# EAGLE design sam3u_breakout (EAGLE 6.3)
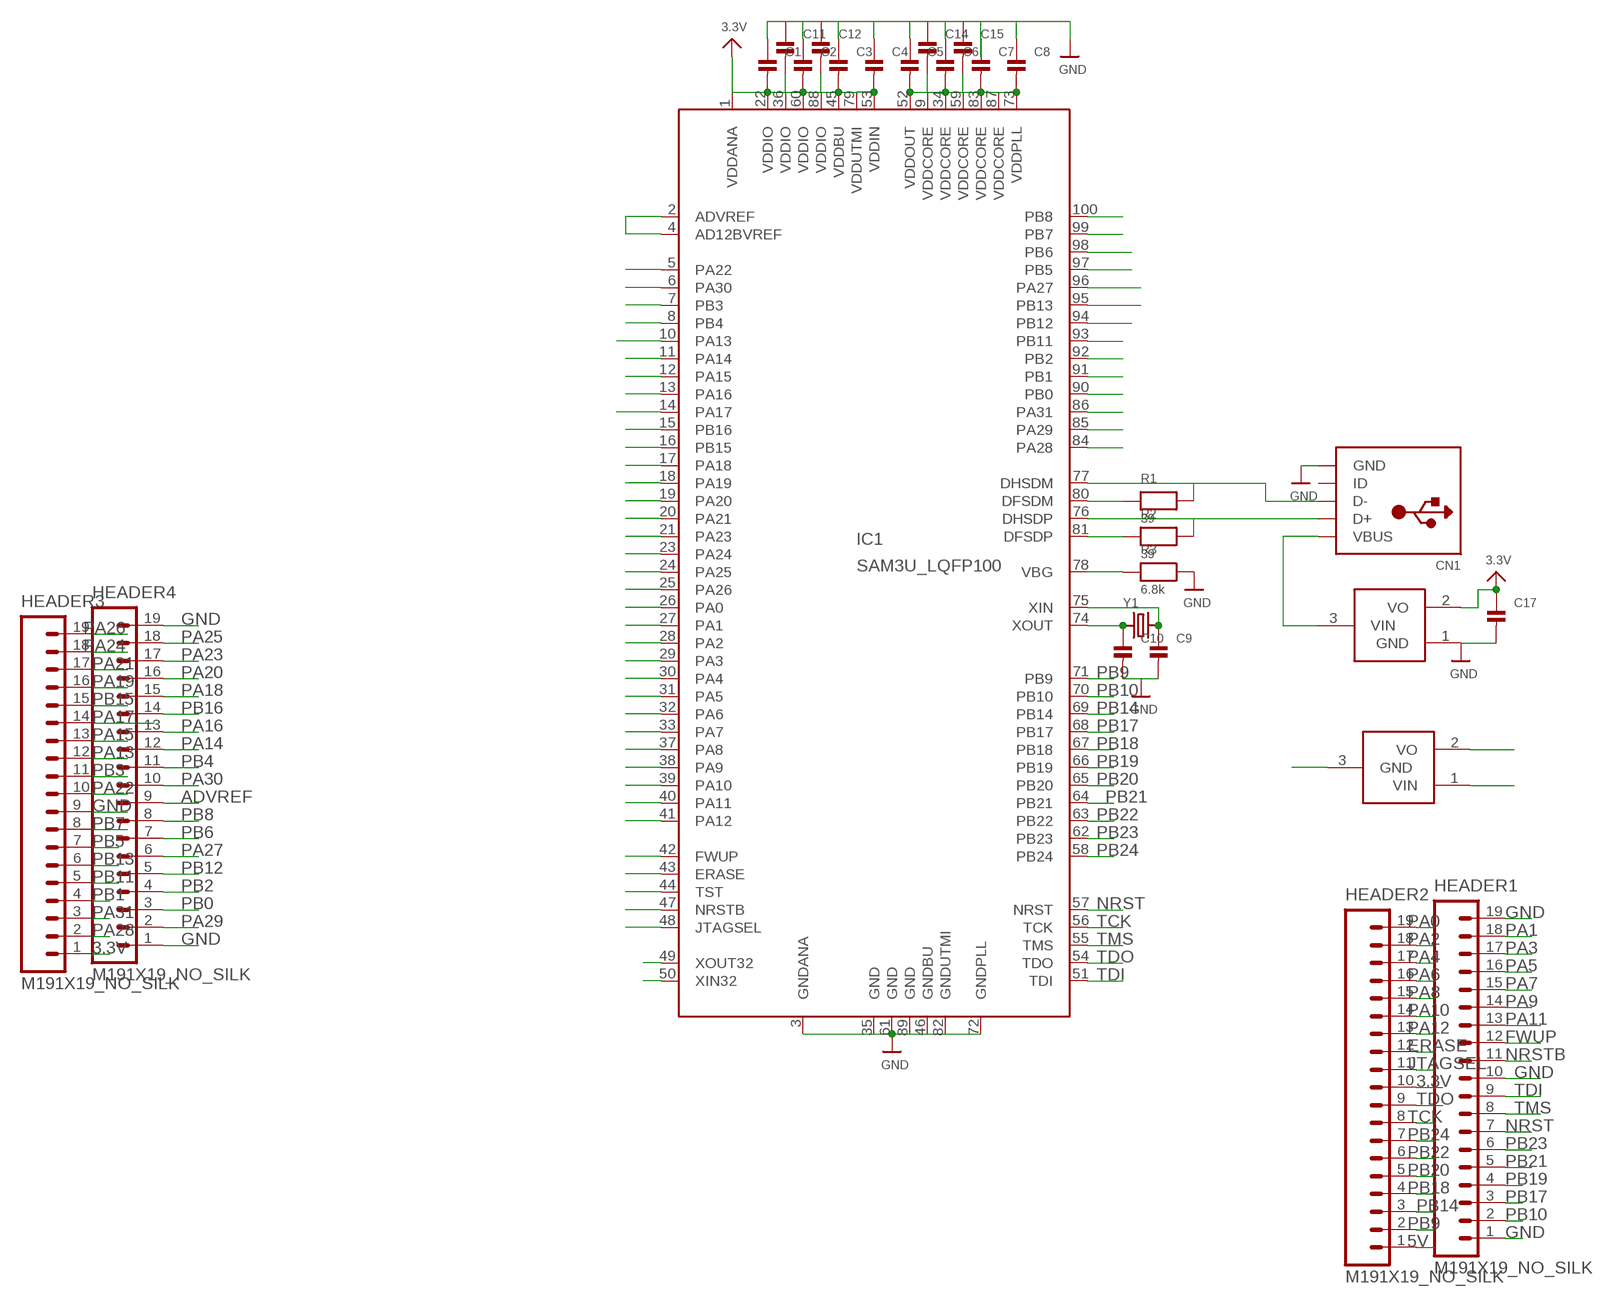
[diagram p0: schematic, sheet 1]

## Parts
C1  CAP_CERAMIC0402  [0402]
C2  CAP_CERAMIC0402  [0402]
C3  CAP_CERAMIC0402  [0402]
C4  CAP_CERAMIC0402  [0402]
C5  CAP_CERAMIC0402  [0402]
C6  CAP_CERAMIC0402  [0402]
C7  CAP_CERAMIC0402  [0402]
C8  CAP_CERAMIC0402  [0402]
C9  CAP_CERAMIC0402  [0402]
C10  CAP_CERAMIC0402  [0402]
C11  CAP_CERAMIC0402  [0402]
C12  CAP_CERAMIC0402  [0402]
C14  CAP_CERAMIC0402  [0402]
C15  CAP_CERAMIC0402  [0402]
C17  CAP_CERAMIC0402  [0402]
CN1  USBMICROB  [USB-MICROB]
HEADER1  M191X19_NO_SILK  [1X19_NO_SILK]
HEADER2  M191X19_NO_SILK  [1X19_NO_SILK]
HEADER3  M191X19_NO_SILK  [1X19_NO_SILK]
HEADER4  M191X19_NO_SILK  [1X19_NO_SILK]
IC1  SAM3U_LQFP100  [LQFP100]
R1  39  RESISTOR0603  [0603]
R2  39  RESISTOR0603  [0603]
R3  6.8k  RESISTOR0603  [0603]
U$7  VREG  [SOT23-3]
U$14  VREF  [SOT23-3]
Y1  CRYSTALSMD  [HC49UP]

## Nets
1.8V: C5.2 C6.2 C7.2 C8.2 C14.2 C15.2 IC1.9(VDDCORE) IC1.34(VDDCORE) IC1.52(VDDOUT) IC1.59(VDDCORE) IC1.73(VDDPLL) IC1.83(VDDCORE) IC1.87(VDDCORE)
3.3V: C1.2 C2.2 C3.2 C4.2 C11.2 C12.2 C17.1 HEADER2.10 HEADER3.1 IC1.1(VDDANA) IC1.22(VDDIO) IC1.36(VDDIO) IC1.45(VDDBU) IC1.53(VDDIN) IC1.60(VDDIO) IC1.79(VDDUTMI) IC1.88(VDDIO) U$7.2(VO) U$14.1(VIN)
5V: CN1.P1(VBUS) HEADER2.1 U$7.3(VIN)
ADVREF: HEADER4.9 IC1.2(ADVREF) IC1.4(AD12BVREF) U$14.2(VO)
ERASE: HEADER2.12 IC1.43(ERASE)
FWUP: HEADER1.12 IC1.42(FWUP)
GND: C1.1 C2.1 C3.1 C4.1 C5.1 C6.1 C8.1 C9.2 C10.2 C11.1 C12.1 C14.1 C15.1 C17.2 CN1.P5(GND) HEADER1.1 HEADER1.10 HEADER1.19 HEADER3.9 HEADER4.1 HEADER4.19 IC1.3(GNDANA) IC1.35(GND) IC1.46(GNDBU) IC1.61(GND) IC1.72(GNDPLL) IC1.82(GNDUTMI) IC1.89(GND) R3.2 U$7.1(GND) U$14.3(GND)
JTAGSEL: HEADER2.11 IC1.48(JTAGSEL)
N$1: CN1.P3(D+) IC1.76(DHSDP) R2.2
N$2: IC1.80(DFSDM) R1.1
N$4: IC1.81(DFSDP) R2.1
N$5: CN1.P2(D-) IC1.77(DHSDM) R1.2
N$6: IC1.78(VBG) R3.1
N$7: C9.1 IC1.75(XIN) Y1.2
N$8: C10.1 IC1.74(XOUT) Y1.1
N$17: IC1.49(XOUT32)
N$18: IC1.50(XIN32)
NRST: HEADER1.7 IC1.57(NRST)
NRSTB: HEADER1.11 IC1.47(NRSTB)
PA0: HEADER2.19 IC1.26(PA0)
PA1: HEADER1.18 IC1.27(PA1)
PA2: HEADER2.18 IC1.28(PA2)
PA3: HEADER1.17 IC1.29(PA3)
PA4: HEADER2.17 IC1.30(PA4)
PA5: HEADER1.16 IC1.31(PA5)
PA6: HEADER2.16 IC1.32(PA6)
PA7: HEADER1.15 IC1.33(PA7)
PA8: HEADER2.15 IC1.37(PA8)
PA9: HEADER1.14 IC1.38(PA9)
PA10: HEADER2.14 IC1.39(PA10)
PA11: HEADER1.13 IC1.40(PA11)
PA12: HEADER2.13 IC1.41(PA12)
PA13: HEADER3.12 IC1.10(PA13)
PA14: HEADER4.12 IC1.11(PA14)
PA15: HEADER3.13 IC1.12(PA15)
PA16: HEADER4.13 IC1.13(PA16)
PA17: HEADER3.14 IC1.14(PA17)
PA18: HEADER4.15 IC1.17(PA18)
PA19: HEADER3.16 IC1.18(PA19)
PA20: HEADER4.16 IC1.19(PA20)
PA21: HEADER3.17 IC1.20(PA21)
PA22: HEADER3.10 IC1.5(PA22)
PA23: HEADER4.17 IC1.21(PA23)
PA24: HEADER3.18 IC1.23(PA24)
PA25: HEADER4.18 IC1.24(PA25)
PA26: HEADER3.19 IC1.25(PA26)
PA27: HEADER4.6 IC1.96(PA27)
PA28: HEADER3.2 IC1.84(PA28)
PA29: HEADER4.2 IC1.85(PA29)
PA30: HEADER4.10 IC1.6(PA30)
PA31: HEADER3.3 IC1.86(PA31)
PB0: HEADER4.3 IC1.90(PB0)
PB1: HEADER3.4 IC1.91(PB1)
PB2: HEADER4.4 IC1.92(PB2)
PB3: HEADER3.11 IC1.7(PB3)
PB4: HEADER4.11 IC1.8(PB4)
PB5: HEADER3.7 IC1.97(PB5)
PB6: HEADER4.7 IC1.98(PB6)
PB7: HEADER3.8 IC1.99(PB7)
PB8: HEADER4.8 IC1.100(PB8)
PB9: HEADER2.2 IC1.71(PB9)
PB10: HEADER1.2 IC1.70(PB10)
PB11: HEADER3.5 IC1.93(PB11)
PB12: HEADER4.5 IC1.94(PB12)
PB13: HEADER3.6 IC1.95(PB13)
PB14: HEADER2.3 IC1.69(PB14)
PB15: HEADER3.15 IC1.16(PB15)
PB16: HEADER4.14 IC1.15(PB16)
PB17: HEADER1.3 IC1.68(PB17)
PB18: HEADER2.4 IC1.67(PB18)
PB19: HEADER1.4 IC1.66(PB19)
PB20: HEADER2.5 IC1.65(PB20)
PB21: HEADER1.5 IC1.64(PB21)
PB22: HEADER2.6 IC1.63(PB22)
PB23: HEADER1.6 IC1.62(PB23)
PB24: HEADER2.7 IC1.58(PB24)
TCK: HEADER2.8 IC1.56(TCK)
TDI: HEADER1.9 IC1.51(TDI)
TDO: HEADER2.9 IC1.54(TDO)
TMS: HEADER1.8 IC1.55(TMS)
TST: IC1.44(TST)
Unconnected: C7.1 CN1.P4(ID)

## Library data of the parts
C1-C12 C14 C15 C17 = nonolith:CAP_CERAMIC: Ceramic Capacitors 0402 - 0402 Surface Mount Capacitors 0.1uF 10V 10% [Digikey: 490-1318-2-ND] 0603 - 0603 Surface Mount Capacitors 16 pF 50V 5% [Digikey: 445-5051-2-ND] 22 pF 50V [Digikey: PCC220ACVTR-ND] 33 pF 50V 5% [Digikey: 490-1415-1-ND] 56pF 50V 5% [Digikey: 490-1421-1-ND] 220pF 50V 5% [Digikey: 445-1285-1-ND] 680 pF 50V 2200 pF 50V 5% C0G [Digikey: 445-1297-1-ND] 5600 pF 100V 5% X7R [Digikey: 478-3711-1-ND] 0.1 µF 25V 10% [Digikey: PCC2277TR-ND] 0.22 µF 16V 10% X7R [Digikey: 445-1318-1-ND] 1.0 µF 25V 10% [Digikey: 445-5146-2-ND] 0603 - RF Specific 3pF 250V +/-0.1pF RF [Digikey: 712-1347-1-ND] 18 pF 250V 5% [Digikey: 478-3505-1-ND or 712-1322-1-ND] 56 pF 250V 5% C0G RF [Digikey: 490-4867-1-ND] 68 pF 250V RF [Digikey: 490-4868-1-ND] 0805 - 0805 Surface Mount Capacitors 220 pF 250V 2% RF Ceramic Capacitor [Digikey: 712-1398-1-ND] 1000 pF 50V 2% NP0 Ceramic Capacitor [Digikey: 478-3760-1-ND] 0.1 µF 25V 10% Ceramic Capacitor [Digikey: PCC1828TR-ND] 1.0 µF 16V 10% Ceramic Capacitor[Digikey: 490-1691-2-ND] 10.0 µF 10V 10% Ceramic Capacitor[Digikey: 709-1228-1-ND] 1206 - 1206 Surface Mount Capacitors
CN1 = nonolith:USB: USB Connectors USBMINIB - Surface Mount Female Mini-B USB Connector 4UConnector: 06564 By microbuilder.eu
HEADER1-HEADER4 = SparkFun-Connectors:M19: 1x19 .1" header
IC1 = nonolith:SAM3U_LQFP100: sam3u_lqfp100 edit this description Auto generated by make-symbol-device-package-bsdl.ulp Rev. 43 Source: sam3u_lqfp100.csv
R1-R3 = nonolith:RESISTOR: Resistors 0402 - 0402 Surface Mount Package 10.0K 1% 1/16W [Digikey: 311-10.0KLRTR-ND] 0603 - 0603 Surface Mount Package 0 Ohm 1/10 Watt 1% Resistor 15 Ohm 1/10 Watt 1% Resistor 33 Ohm 1/10 Watt 1% Resistor 49.9 Ohm 1/10 Watt 1% Resistor 100 Ohm 1/10 Watt 1% Resistor 150 Ohm 1/10 Watt 1% Resistor 240 Ohm 1/10 Watt 1% Resistor 390 Ohm 1/10 Watt 1% Resistor 560 Ohm 1/10 Watt 1% Resistor 750 Ohm 1/10 Watt 1% Resistor 1.0K Ohm 1/10 Watt 1% Resistor 1.5K Ohm 1/10 Watt 1% Resistor 2.0K Ohm 1/10 Watt 1% Resistor 4.7K Ohm 1/10 Watt 1% Resistor 10.0K Ohm 1/10 Watt 1% Resistor 20.0K Ohm 1/10 Watt 1% Resistor 33.0K Ohm 1/10 Watt 1% Resistor 100.0K Ohm 1/10 Watt 1% Resistor 0805 - 0805 Surface Mount Package 0 Ohm 1/8 Watt 1% Resistor 33 Ohm 1/8 Watt 1% Resistor 100 Ohm 1/8 Watt 1% Resistor 150 Ohm 1/8 Watt 1% Resistor 200 Ohm 1/8 Watt 1% Resistor 240 Ohm 1/8 Watt 1% Resistor 330 Ohm 1/8 Watt 1% Resistor 390 Ohm 1/8 Watt 1% Resistor 470 Ohm 1/8 Watt 1% Resistor 1.0K Ohm 1/8 Watt 1% Resistor 1.5K Ohm 1/8 Watt 1% Resistor 2.0K Ohm 1/8 Watt 1% Resistor 4.7K Ohm 1/8 Watt 1% Resistor 5.1K Ohm 1/8 Watt 1% Resistor 5.6K Ohm 1/8 Watt 1% Resistor 10.0K Ohm 1/8 Watt 1% Resistor 22.0K Ohm 1/8 Watt 1% Resistor 33.0K Ohm 1/8 Watt 1% Resistor 100K Ohm 1/8 Watt 1% Resistor 1206 - 1206 Surface Mount Package
U$7 = nonolith:VREG
U$14 = nonolith:VREF
Y1 = nonolith:CRYSTAL: Crystals HC49UP - Surface Mount Crystal 4.0MHz 18pF +/-30ppm Surface Mount Crystal [Digikey: 535-9857-1-ND] 12.0 MHz Surface Mount Crystal [Digikey: 535-9869-6-ND] 25.0 MHz Surface Mount Crystal [Digikey: 535-9078-1-ND] 3.2 x 2.5mm - MEMs SMT Crystal 12.0 MHz 8pF 15ppm 3.2 x 2.5mm Crystal [Digikey: 644-1047-1-ND] 16.0 MHz 8pF 15ppm 3.2 x 2.5mm Crystal [Digikey: 644-1049-1-ND] 16.0 MHz 10pF 10ppm 3.2 x 2.5mm Crystal [Digikey: 644-1100-1-ND] 27.12 MHz 18pF 30ppm 3.2 x 2.5mm Crystal [Digikey: 887-1424-1-ND] 4.9 x 1.8mm - MEMs SMT Crystal 32.768 KHz 12.5pF 20ppm 4.9 x 1.8mm Crystal [Digikey: SE2415CT-ND] Cylinder 32.768KHz Cylinder Crystal

## Board
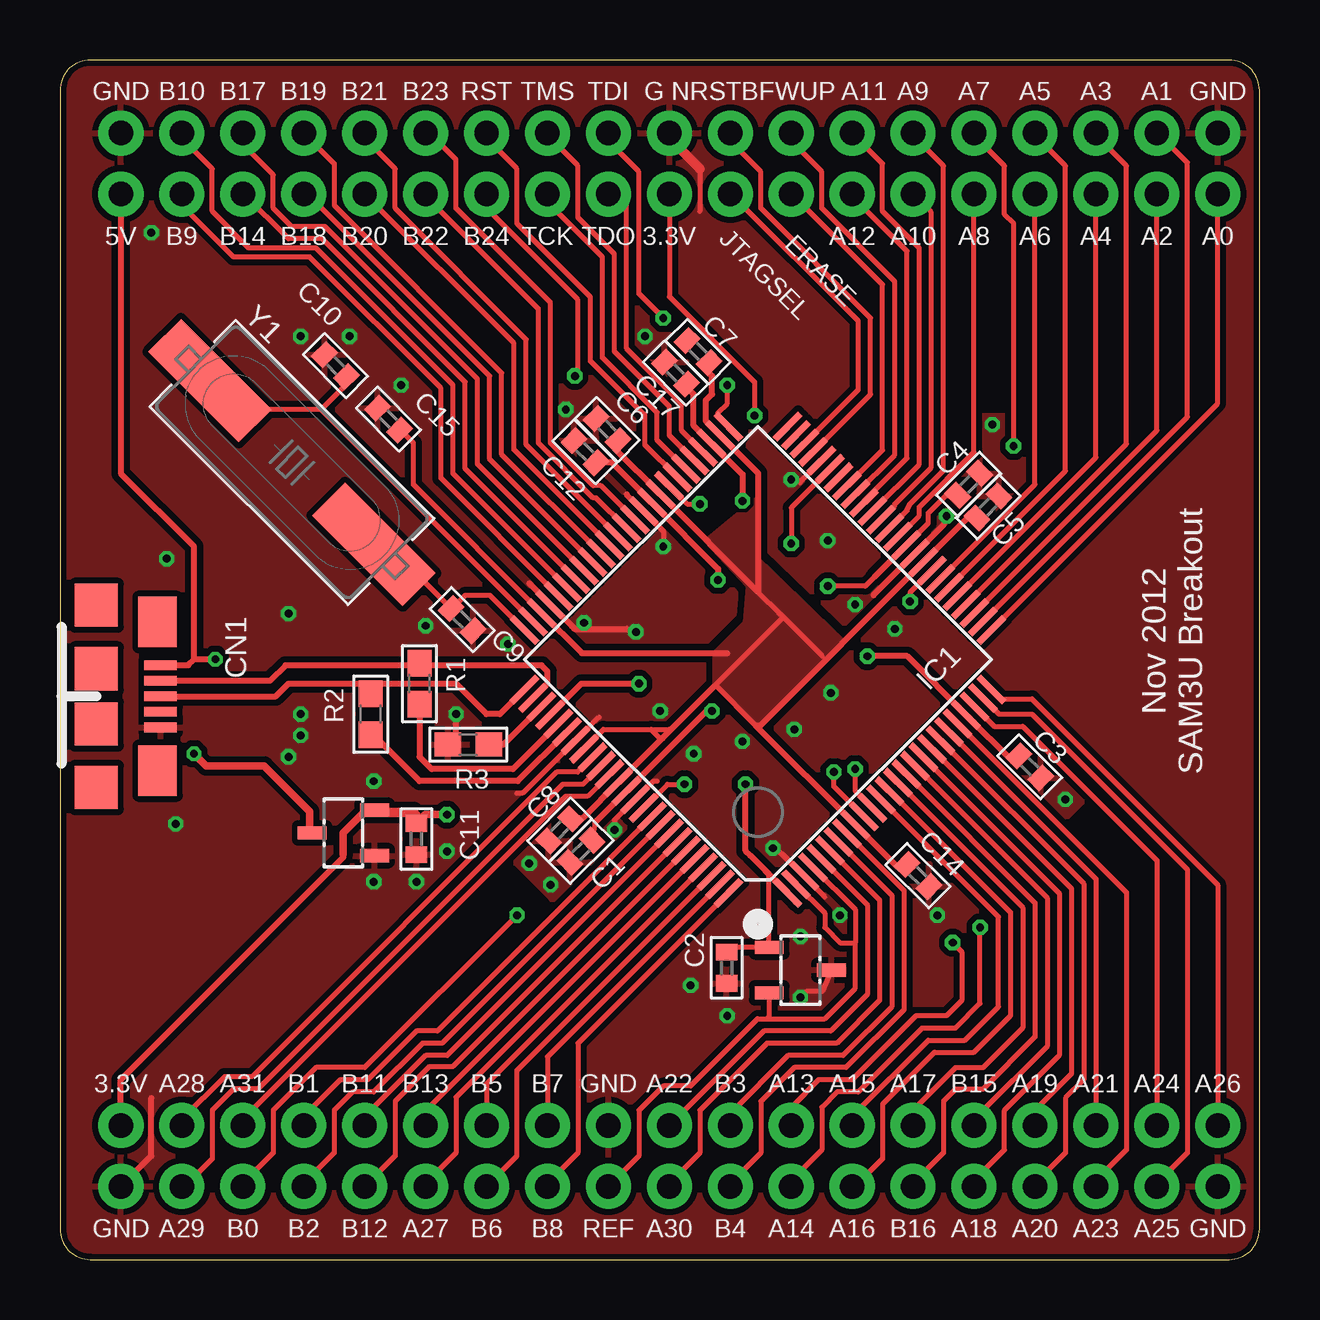
[diagram p1: board, top side]
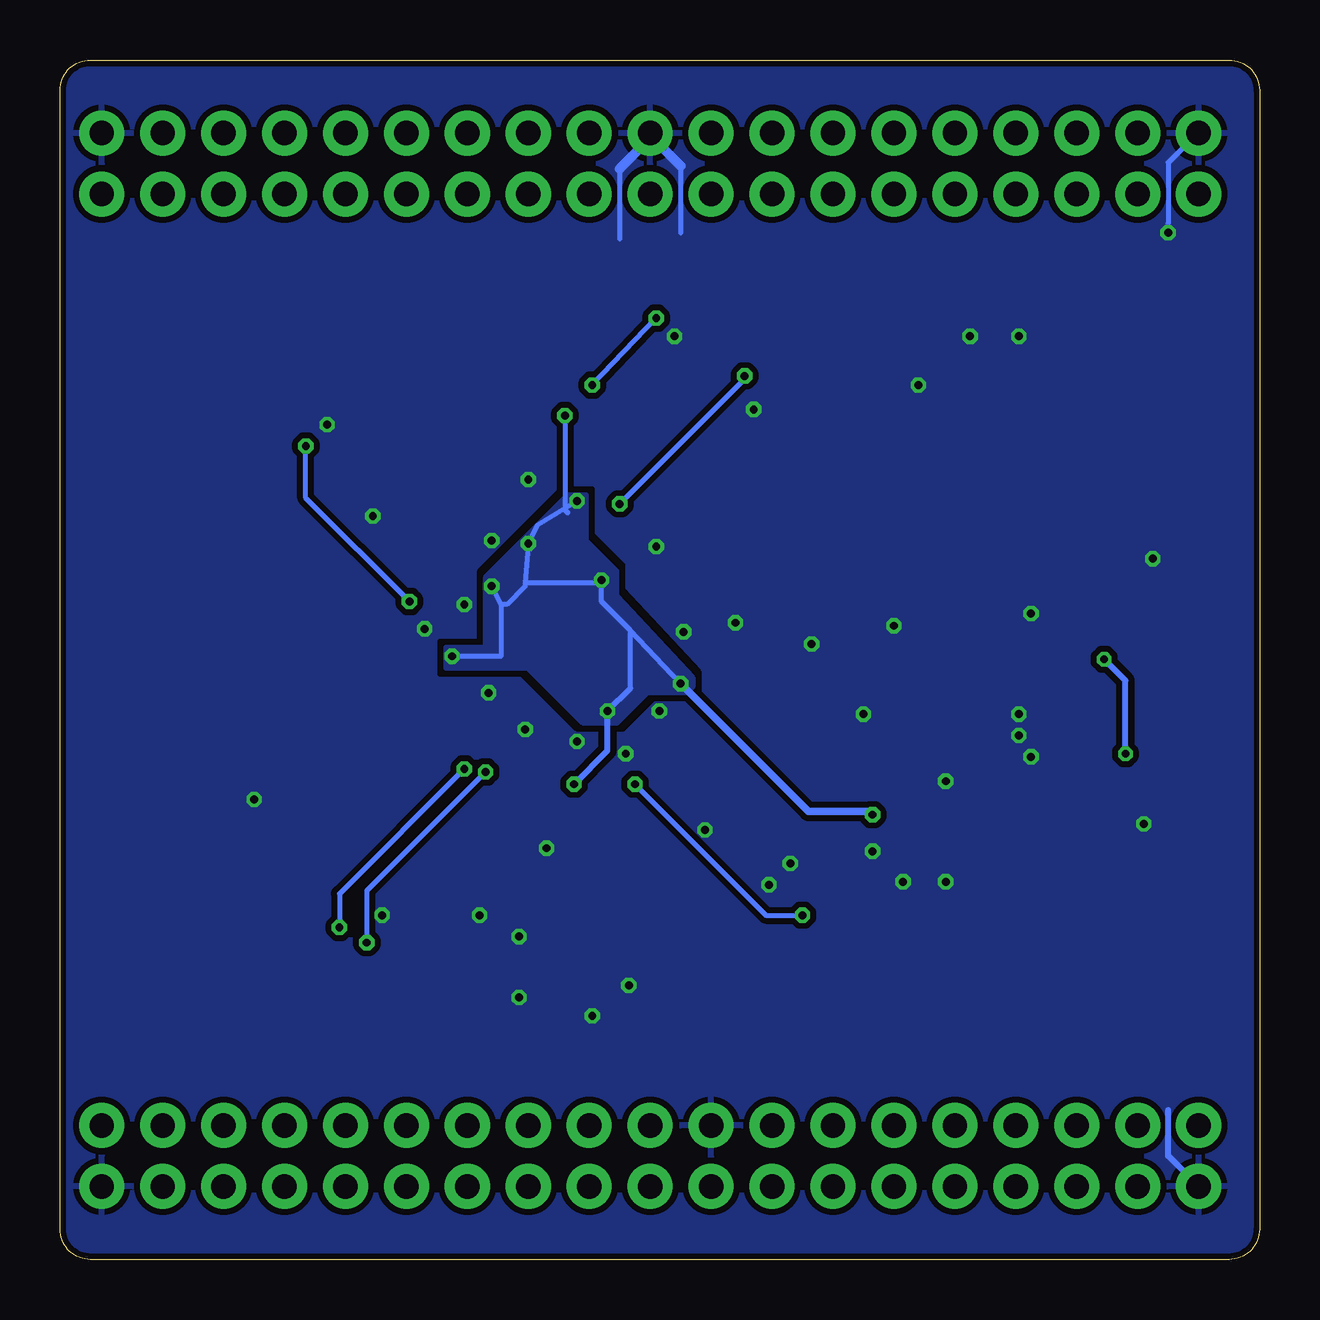
[diagram p2: board, bottom side, seen from below]

Size 50 x 50 mm. Coordinates in mm from the lower left corner, seen from the top.
Outline: 0,48.73 0,1.27 arc90 1.27,0 48.73,0 arc90 50,1.27 50,48.73 arc90 48.73,50 1.27,50 arc90 0,48.73
Copper layers (1*16): Top 0.035mm / dielectric 1.5mm / Bottom 0.035mm
Design rules "default": minimum track width 6mil, minimum drill 12mil, track to track 6mil, track to pad 6mil, pad to pad 6mil, via to via 6mil, smd to smd 0mil, copper to edge 10mil, drill to drill 10mil, minimum pad ring 10mil, minimum via ring 6mil, stop-mask expansion 20mil, vias tented up to drill 100mil, thermal gap 10mil
tRestrict: 3 lines

### Footprints (pad centres in the part's own frame; a part is rotated, then mirrored left to right if it is on the bottom)
0402 = smd 0.7 x 0.9: 1 -0.65,0; 2 0.65,0
USB-MICROB = smd 0.4 x 1.35: P1 -1.3,2.675; P2 -0.65,2.675; P3 0,2.675; P4 0.65,2.675; P5 1.3,2.675 | smd 1.8 x 1.8: PAD-LB -1.15,0; PAD-LLB -3.8,0; PAD-RB 1.15,0; PAD-RRB 3.8,0 | smd 2.1 x 1.6: PAD-LT -3.1,2.55; PAD-RT 3.1,2.55
1X19_NO_SILK = drill 1.016 pad 1.88: 1 0,0; 2 2.54,0; 3 5.08,0; 4 7.62,0; 5 10.16,0; 6 12.7,0; 7 15.24,0; 8 17.78,0; 9 20.32,0; 10 22.86,0; 11 25.4,0; 12 27.94,0; 13 30.48,0; 14 33.02,0; 15 35.56,0; 16 38.1,0; 17 40.64,0; 18 43.18,0; 19 45.72,0
LQFP100 = smd 0.27 x 1.5: 1 -6,-7.75; 2 -5.5,-7.75; 3 -5,-7.75; 4 -4.5,-7.75; 5 -4,-7.75; 6 -3.5,-7.75; 7 -3,-7.75; 8 -2.5,-7.75; 9 -2,-7.75; 10 -1.5,-7.75; 11 -1,-7.75; 12 -0.5,-7.75; 13 0,-7.75; 14 0.5,-7.75; 15 1,-7.75; 16 1.5,-7.75; 17 2,-7.75; 18 2.5,-7.75; 19 3,-7.75; 20 3.5,-7.75; 21 4,-7.75; 22 4.5,-7.75; 23 5,-7.75; 24 5.5,-7.75; 25 6,-7.75; 51 6,7.75; 52 5.5,7.75; 53 5,7.75; 54 4.5,7.75; 55 4,7.75; 56 3.5,7.75; 57 3,7.75; 58 2.5,7.75; 59 2,7.75; 60 1.5,7.75; 61 1,7.75; 62 0.5,7.75; 63 0,7.75; 64 -0.5,7.75; 65 -1,7.75; 66 -1.5,7.75; 67 -2,7.75; 68 -2.5,7.75; 69 -3,7.75; 70 -3.5,7.75; 71 -4,7.75; 72 -4.5,7.75; 73 -5,7.75; 74 -5.5,7.75; 75 -6,7.75 | smd 1.5 x 0.27: 26 7.75,-6; 27 7.75,-5.5; 28 7.75,-5; 29 7.75,-4.5; 30 7.75,-4; 31 7.75,-3.5; 32 7.75,-3; 33 7.75,-2.5; 34 7.75,-2; 35 7.75,-1.5; 36 7.75,-1; 37 7.75,-0.5; 38 7.75,0; 39 7.75,0.5; 40 7.75,1; 41 7.75,1.5; 42 7.75,2; 43 7.75,2.5; 44 7.75,3; 45 7.75,3.5; 46 7.75,4; 47 7.75,4.5; 48 7.75,5; 49 7.75,5.5; 50 7.75,6; 76 -7.75,6; 77 -7.75,5.5; 78 -7.75,5; 79 -7.75,4.5; 80 -7.75,4; 81 -7.75,3.5; 82 -7.75,3; 83 -7.75,2.5; 84 -7.75,2; 85 -7.75,1.5; 86 -7.75,1; 87 -7.75,0.5; 88 -7.75,0; 89 -7.75,-0.5; 90 -7.75,-1; 91 -7.75,-1.5; 92 -7.75,-2; 93 -7.75,-2.5; 94 -7.75,-3; 95 -7.75,-3.5; 96 -7.75,-4; 97 -7.75,-4.5; 98 -7.75,-5; 99 -7.75,-5.5; 100 -7.75,-6
0603 = smd 1.1 x 1: 1 -0.85,0; 2 0.85,0
SOT23-3 = smd 0.55 x 1.2: 1 0.95,1.3; 2 -0.95,1.3; 3 0,-1.3
HC49UP = smd 5.334 x 1.93: 1 -4.826,0; 2 4.826,0

### Placement (x,y rotation side)
C1  21.72,17.02 45 top
C2  27.79,12.16 90 top
C3  40.42,20.54 135 top
C4  37.88,32.31 225 top
C5  38.68,31.37 225 top
C6  22.81,34.6 315 top
C7  26.6,37.85 315 top
C8  20.83,17.91 45 top
C9  16.76,26.67 315 top
C10  11.48,37.26 135 top
C11  14.86,17.53 90 top
C12  21.88,33.67 315 top
C14  35.76,16 135 top
C15  13.69,35.03 315 top
C17  25.65,36.95 135 top
CN1  1.52,23.48 270 top
HEADER1  2.54,46.95 0 top
HEADER2  2.54,44.41 0 top
HEADER3  2.54,5.59 0 top
HEADER4  2.54,3.05 0 top
IC1  29.09,25 45 top
R1  14.99,24 90 top
R2  12.95,22.73 90 top
R3  17.02,21.46 180 top
U$7  11.81,17.78 270 top
U$14  30.86,12.06 90 top
Y1  9.67,33.23 315 top

### Tracks (layer width: path | path; a pad name or v marks a point on that pad's centre or on a via)
1.8V
  Top 0.203: 23.11,33.81 23.11,33.91 | 21.8,18.41 21.21,18.41 21.26,18.37 C8.2 | 37.84,30.92 C5.2 | 29.1,27.83 30,26.92 | 29.19,22.27 29,22.27 27.37,23.9 27.28,23.9 30.1,26.71 30.1,26.8 | 31.78,25.15 30,26.92 | 30,26.92 29.97,26.92 | 24.64,22.1 25.4,22.1 | IC1.83 22.65,22.1 24.64,22.1 | 24.64,22.1 25,21.74 25.12,21.74 | IC1.73 14.73,32.29 14.73,34.04 14.2,34.57 C15.2 | C14.2 35.22,16.38 35.18,16.38
  Top 0.254: 23.11,33.81 IC1.59 29.1,27.83 29.1,32.78 IC1.52 26.92,34.95 26.92,35.81 27.18,36.07 27.18,36.83 27.05,36.95 C7.2 | 21.8,18.41 IC1.87 25.12,21.74 27.28,23.9 | 37.84,30.92 IC1.34 29.19,22.27 | 29,22.27 IC1.9 34.89,16.38 35.18,16.38 35.56,16.38 | IC1.73 21.75,25.27 27.81,25.27 | 23.11,33.91 23.27,34.06 C6.2
  pour Top: 28.7,28.07 26.92,29.97 29.08,31.75 29.08,29.21 32.64,25.78 29.08,22.23 27.3,24 27.3,25.27 28.57,26.54
3.3V  (via drill 0.33)
  Top 0.203: 22.3,18.21 C1.2 | 39.71,20.75 C3.2 | IC1.36 36.2,30.69 36.2,31.11 36.91,31.83 C4.2 | IC1.45 30.48,31.34 v30.48,29.84 | 26.95,22.86 v27.18,22.86 | 30.65,14.87 30.74,14.87 | 27.46,12.86 C2.2 28,13.02 U$14.1 29.56,16.03 | 29.56,16.03 29.21,16.38 29.21,16.4 28.77,16.84 | 29.56,16.03 29.59,16 | U$7.2 13.68,18.54 14.86,18.54 C11.2 | 33.95,28.45 33.57,28.07 v32,28.07 | HEADER2.10 25.4,40.13 28.96,36.58 v28.96,35.18
  Top 0.254: 22.3,18.21 IC1.88 26.95,22.86 | 39.71,20.75 IC1.22 35.31,25.15 v33.66,25.15 | IC1.36 33.95,28.45 | v28.45,31.62 28.45,32.72 IC1.53 26.42,34.75 26.42,36.07 26.11,36.37 C17.1 | v27.43,28.32 27.43,28.79 IC1.60 23.01,33.21 C12.2 | IC1.79 21.73,24 v24.13,24 | v28.57,19.81 28.57,17.04 28.77,16.84 IC1.1 30.74,14.87 | HEADER3.1 2.54,7.49 11.81,16.76 11.81,16.89
  Top 0.305: C11.2 15.22,18.54 v16.13,18.54 | 11.81,16.89 11.81,17.78 12.76,18.73 U$7.2 | 14.86,18.54 14.73,18.67 13.08,18.67
  Bottom 0.203: v33.66,25.15 31.62,25.15 31.62,27.3 | v32,28.07 31.62,27.3 | 30.61,28.19 30.48,29.72 v30.48,29.84 30.1,30.61 v28.45,31.62 | 30.61,28.19 30.61,28.07 31.37,27.3 31.62,27.3 | 30.61,28.19 27.56,28.19 v27.43,28.32 27.43,27.43 26.23,26.23 | v24.13,24 26.23,26.23 | 26.23,23.81 26.23,26.23 | v28.96,35.18 28.96,31.24 28.83,31.11
  Bottom 0.254: 26.23,23.81 v27.18,22.86 27.18,21.21 v28.57,19.81
  Bottom 0.305: v16.13,18.54 16.26,18.67 18.8,18.67 v24.13,24
  pour Bottom: 30.48,24.64 33.91,24.64 33.91,25.53 32.26,25.53 32.26,28.45 28.83,31.88 28.07,31.88 28.07,29.97 26.8,28.7 26.8,27.69 23.62,24.26 23.62,23.88 23.88,23.62 25.53,23.62 26.8,22.35 28.19,22.35
5V  (via drill 0.3)
  Top 0.203: 10.41,18.03 10.51,17.94 U$7.3
  Top 0.254: 5.59,25.02 5.59,29.72 2.54,32.77 HEADER2.1 | CN1.P1 5.34,24.78 5.59,25.02 | v6.48,25.02 5.59,25.02
  Top 0.305: v5.59,21.08 6.1,20.57 8.51,20.57 10.41,18.67 10.41,18.03
  Bottom 0.254: v5.59,21.08 5.59,24.13 v6.48,25.02
ADVREF
  Top 0.203: IC1.4 33.15,14.59 33.15,13.21 | IC1.2 31.88,14.44 31.88,13.84 32.51,13.21 33.15,13.21 | HEADER4.9 24.13,4.32 24.13,6.22 25.15,7.24 26.29,7.24 29.08,10.03 29.46,10.03 | 29.46,10.03 31.88,10.03 33.15,11.3 33.15,13.21 | U$14.2 29.56,10.13 29.46,10.03
ERASE
  Top 0.203: IC1.43 34.29,33.73 34.29,40.64 30.52,44.41 HEADER2.12
FWUP
  Top 0.203: IC1.42 34.8,33.53 34.8,40.77 31.75,43.81 31.75,45.34 30.61,46.48 30.61,46.74 30.48,46.86 HEADER1.12
GND  (via drill 0.33)
  Top 0.203: v23.11,17.91 23.11,18.32 IC1.89 24.74,19.94 24.89,19.94 | 36.83,30.62 v36.96,30.99 | IC1.3 30.14,16.89 30.1,16.89 | IC1.72 21.34,26.4 | 25.15,30.35 24.64,30.86 | IC1.46 30.86,32.43 30.86,32.38 | IC1.82 19.28,19.43 19.05,19.43 | 21.72,21.84 22.48,22.61 | U$14.3 31.78,11.21 31.75,11.18 31.11,11.18 v30.86,10.92 | 26.67,45.47 26.67,43.69 | 31.88,15.11 29.84,17.14 v29.72,17.14 | IC1.61 25.15,30.36 v25.15,29.72
  Top 0.254: R3.2 16.51,21.8 v16.51,22.73 | IC1.61 23.62,31.89 | 36.83,30.62 IC1.35 33.91,27.7 | 19.56,28.19 21.46,26.29 | 21.46,26.29 23.62,26.29 v24,26.16 | 21.34,26.4 21.44,26.29 21.46,26.29 | HEADER4.1 3.81,4.32 3.81,6.73
  Top 0.406: 25.4,46.74 26.67,45.47
  Bottom 0.203: 24.13,45.59 24.13,42.8 | 26.67,45.47 26.67,42.55 | 2.54,46.99 3.81,45.72 3.81,43.18
  Bottom 0.254: HEADER4.1 3.81,4.32 3.81,6.22
  Bottom 0.406: 25.4,46.86 24.13,45.59 | 25.27,46.86 26.67,45.47
  other vias: 10.03,38.48 21.08,35.43 20.45,15.62 18.67,25.65 12.06,38.48 30.61,22.1 32.13,23.62 34.8,26.29 33.15,27.3 21.84,26.54 25.02,22.86 28.45,21.59 26.42,21.08 32,29.97 41.91,19.18 36.58,14.35 30.86,13.46 32.51,14.35 27.81,10.16 10.03,22.73 10.03,21.84 9.53,20.95 16.13,17.02 13.08,15.75 14.86,15.75 13.08,19.94 19.56,16.51 38.86,34.8 30.48,32.51 24.38,38.48 14.22,36.45 15.24,26.42 9.53,26.92 4.83,18.16 4.45,29.21 3.81,42.8 26.29,11.43
  pour Top (isolate 0.254, rank 6): -5.08,50.8 50.8,50.8 50.8,-5.08 -5.08,-5.08
  pour Bottom (isolate 0.254, rank 6): -2.54,50.8 50.8,50.8 50.8,-2.54 -2.54,-2.54
JTAGSEL
  Top 0.203: IC1.48 33.27,36.25 33.27,39.12 27.98,44.41 HEADER2.11
N$1
  Top 0.254: 12.7,24 16.51,24 17.78,22.73 18.34,22.73 IC1.76 | R2.2 12.7,24 | 12.7,24 9.53,24 9,23.48 CN1.P3
N$2
  Top 0.254: IC1.80 18.88,20.45 15.49,20.45 14.99,20.95 R1.1
N$4
  Top 0.254: IC1.81 19.08,19.94 14.99,19.94 13.04,21.88 R2.1
N$5
  Top 0.254: IC1.77 20.32,24.01 20.32,24.51 20.07,24.77 | 20.08,24.77 20.07,24.77 | 20.07,24.77 14.99,24.77 | 14.99,24.77 R1.2 14.95,24.89 | 14.99,24.77 14.95,24.8 | 14.99,24.77 9.4,24.77 8.76,24.13 CN1.P2
N$6
  Top 0.254: IC1.78 18.48,21.46 R3.1
N$7
  Top 0.203: IC1.75 17.93,27.69 16.89,27.69 16.34,27.13 C9.1 13.62,29.81 Y1.2
N$8
  Top 0.203: IC1.74 10.89,35.43 | 10.89,35.43 7.75,35.43 6.54,36.64 Y1.1 | 10.89,35.43 12,36.55 C10.1
NRST
  Top 0.203: HEADER1.7 17.78,46.74 19.05,45.47 19.05,43.18 22.1,40.13 22.1,37.47 24.38,35.18 24.38,33.96 IC1.57
NRSTB
  Top 0.203: IC1.47 33.78,36.05 33.78,39.24 29.21,43.81 29.21,45.34 27.94,46.61 HEADER1.11
PA0
  Top 0.203: IC1.26 48.26,35.68 HEADER2.19
PA1
  Top 0.203: IC1.27 46.99,35.12 46.99,45.72 45.76,46.95 HEADER1.18
PA2
  Top 0.203: IC1.28 45.72,34.56 HEADER2.18
PA3
  Top 0.203: IC1.29 44.45,33.99 44.45,45.59 43.18,46.86 HEADER1.17
PA4
  Top 0.203: IC1.30 43.18,33.43 HEADER2.17
PA5
  Top 0.203: IC1.31 41.91,32.87 41.91,45.59 40.64,46.86 HEADER1.16
PA6
  Top 0.203: IC1.32 40.64,32.31 HEADER2.16
PA7  (via drill 0.33)
  Top 0.203: IC1.33 35.43,27.81 v35.43,27.43 | v39.75,33.91 39.75,43.18 39.37,43.56 39.37,45.59 38.1,46.86 HEADER1.15
  Bottom 0.203: v35.43,27.43 39.75,31.75 v39.75,33.91
PA8
  Top 0.203: HEADER2.15 38.1,33.66 35.81,31.37 35.81,31.02 IC1.37
PA9
  Top 0.203: IC1.38 35.31,31.21 35.43,31.5 36.83,32.89 36.83,45.59 35.56,46.86 HEADER1.14
PA10
  Top 0.203: IC1.39 34.8,31.41 34.8,31.5 36.32,33.02 36.32,43.65 HEADER2.14
PA11
  Top 0.203: HEADER1.13 34.29,45.68 34.29,43.69 35.81,42.16 35.81,33.14 IC1.40
PA12
  Top 0.203: IC1.41 33.51,31.61 35.31,33.4 35.31,42.04 33.02,44.32 HEADER2.13
PA13  (via drill 0.33)
  Top 0.203: IC1.10 32.26,19.72 v32.26,20.32 | v37.21,13.21 37.59,12.83 37.59,10.79 36.96,10.16 35.69,10.16 33.02,7.49 31.62,7.49 30.48,6.35 HEADER3.12
  Bottom 0.203: v32.26,20.32 37.21,15.37 v37.21,13.21
PA14  (via drill 0.33)
  Top 0.203: IC1.11 33.15,19.54 v33.15,20.45 | HEADER4.12 30.48,3.3 31.75,4.57 31.75,6.35 32.38,6.99 33.27,6.99 35.94,9.65 37.34,9.65 38.35,10.67 v38.35,13.84
  Bottom 0.203: v33.15,20.45 38.35,15.24 v38.35,13.84
PA15
  Top 0.203: IC1.12 39.12,14.27 39.12,10.54 37.72,9.14 36.2,9.14 33.02,5.97 HEADER3.13
PA16
  Top 0.203: IC1.13 39.62,14.47 39.62,10.16 38.1,8.64 36.45,8.64 34.29,6.48 34.29,4.19 33.15,3.05 HEADER4.13
PA17
  Top 0.203: IC1.14 40.13,14.67 40.13,9.65 38.48,8 37.34,8 35.56,6.22 HEADER3.14
PA18
  Top 0.203: IC1.17 41.66,15.27 41.66,8.51 39.37,6.22 39.37,4.57 38.1,3.3 HEADER4.15
PA19
  Top 0.203: IC1.18 42.16,15.47 42.16,7.75 40.64,6.22 HEADER3.16
PA20
  Top 0.203: IC1.19 42.67,15.67 42.67,7.49 41.91,6.73 41.91,4.45 40.64,3.17 HEADER4.16
PA21
  Top 0.203: IC1.20 43.18,15.87 HEADER3.17
PA22
  Top 0.203: IC1.5 33.66,14.79 33.66,11.05 32.13,9.53 29.34,9.53 HEADER3.10
PA23
  Top 0.203: IC1.21 44.45,15.3 44.45,4.57 43.18,3.3 HEADER4.17
PA24
  Top 0.203: IC1.23 38.94,22.23 40.13,22.23 45.72,16.64 HEADER3.18
PA25
  Top 0.203: IC1.24 39.14,22.73 40.51,22.73 46.99,16.26 46.99,4.45 45.72,3.17 HEADER4.18
PA26
  Top 0.203: IC1.25 39.21,23.37 40.51,23.37 48.26,15.62 HEADER3.19
PA27
  Top 0.203: HEADER4.6 15.24,3.17 16.51,4.45 16.51,6.76 IC1.96
PA28
  Top 0.203: IC1.84 21.58,20.32 20.7,20.32 8,7.62 6.86,7.62 5.08,5.84 HEADER3.2
PA29
  Top 0.203: IC1.85 21.78,19.81 20.95,19.81 8.26,7.11 7.24,7.11 6.35,6.22 6.35,4.19 5.21,3.05 HEADER4.2
PA30
  Top 0.203: IC1.6 34.16,14.98 34.16,10.79 32.38,9.02 29.46,9.02 26.67,6.22 26.67,4.45 25.4,3.17 HEADER4.10
PA31
  Top 0.203: IC1.86 21.98,19.3 21.08,19.3 7.62,5.84 HEADER3.3
PB0  (via drill 0.33)
  Top 0.203: HEADER4.3 7.62,3.17 8.89,4.45 8.89,6.22 10.67,8 12.7,8 v19.05,14.35 | IC1.90 25.32,19.81 v26.04,19.81
  Bottom 0.203: v26.04,19.81 20.57,14.35 v19.05,14.35
PB1
  Top 0.203: HEADER3.4 10.16,5.97 11.68,7.49 12.83,7.49 14.86,9.53 15.74,9.53 IC1.91
PB2
  Top 0.203: HEADER4.4 10.16,3.17 11.43,4.45 11.43,6.22 12.19,6.99 13.08,6.99 15.11,9.02 15.94,9.02 IC1.92
PB3
  Top 0.203: IC1.7 34.67,15.18 34.67,10.54 32.64,8.51 30.35,8.51 27.94,6.1 HEADER3.11
PB4
  Top 0.203: IC1.8 35.18,15.38 35.18,10.41 32.77,8 30.61,8 29.21,6.6 29.21,4.45 27.94,3.17 HEADER4.11
PB5
  Top 0.203: 17.65,5.71 17.65,5.46 HEADER3.7 | HEADER3.7 17.91,5.71 | IC1.97 17.78,7.33 HEADER3.7
PB6
  Top 0.203: HEADER4.7 19.05,4.32 19.05,6.48 19.05,6.6 19.05,7.89 IC1.98
PB7
  Top 0.203: 20.32,5.84 HEADER3.8 20.32,8.45 IC1.99
PB8
  Top 0.203: HEADER4.8 20.32,3.17 21.59,4.45 21.59,9.01 IC1.100
PB9
  Top 0.203: IC1.71 15.88,32.56 15.88,36.32 10.41,41.78 7.24,41.78 5.08,43.94 HEADER2.2
PB10
  Top 0.203: IC1.70 16.38,32.76 16.38,36.45 10.67,42.16 7.87,42.16 6.35,43.69 6.35,45.47 5.08,46.74 HEADER1.2
PB11
  Top 0.203: HEADER3.5 12.7,5.97 15.24,8.51 16.14,8.51 IC1.93
PB12
  Top 0.203: HEADER4.5 13.97,4.32 13.97,6.6 15.41,8.05 16.38,8.05 IC1.94
PB13
  Top 0.203: IC1.95 15.24,6.2 HEADER3.6
PB14
  Top 0.203: IC1.69 16.89,32.96 16.89,36.58 10.92,42.55 9.53,42.55 7.66,44.41 HEADER2.3
PB15
  Top 0.203: IC1.16 41.15,15.07 41.15,8.89 38.35,6.1 38.35,5.84 HEADER3.15
PB16
  Top 0.203: IC1.15 40.64,14.87 40.64,9.27 38.48,7.11 37.34,7.11 36.83,6.6 36.83,4.45 35.56,3.17 HEADER4.14
PB17
  Top 0.203: IC1.68 17.4,33.16 17.4,36.7 11.05,43.05 9.65,43.05 8.89,43.81 8.89,45.21 7.62,46.48 HEADER1.3
PB18
  Top 0.203: IC1.67 17.91,33.36 17.91,36.83 10.29,44.45 | 10.29,44.45 10.03,44.45 | 10.29,44.45 10.25,44.41 HEADER2.4
PB19
  Top 0.203: IC1.66 18.41,33.56 18.41,36.96 11.43,43.94 11.43,45.68 HEADER1.4
PB20
  Top 0.203: IC1.65 18.92,33.76 18.92,38.19 HEADER2.5
PB21
  Top 0.203: IC1.64 19.43,33.96 19.43,38.35 13.97,43.81 13.97,45.47 12.7,46.74 HEADER1.5
PB22
  Top 0.203: IC1.63 22.35,31.75 22.23,31.75 19.94,34.04 19.94,39.62 15.24,44.32 HEADER2.6
PB23
  Top 0.203: IC1.62 22.55,32.26 22.23,32.26 20.45,34.04 20.45,39.88 16.51,43.81 16.51,45.85 15.4,46.95 HEADER1.6
PB24  (via drill 0.33)
  Top 0.203: IC1.58 26.14,31.5 v26.67,31.5 | v21.46,36.83 21.59,36.96 21.59,40.01 17.78,43.81 HEADER2.7
  Bottom 0.203: v26.67,31.5 21.46,36.7 v21.46,36.83
TCK
  Top 0.203: IC1.56 24.89,34.16 24.89,35.31 22.61,37.59 22.61,41.78 20.32,44.07 HEADER2.8
TDI  (via drill 0.33)
  Top 0.203: IC1.51 27.43,35.15 27.43,35.31 27.81,35.69 v27.81,36.45 | v25.15,39.24 24.13,40.26 24.13,45.34 22.86,46.61 HEADER1.9
  Bottom 0.203: v27.81,36.45 v25.15,39.24
TDO
  Top 0.203: IC1.54 25.91,34.55 25.91,35.69 23.62,37.97 23.62,44.2 23.41,44.41 HEADER2.9
TMS
  Top 0.203: IC1.55 25.4,34.35 25.4,35.56 23.11,37.85 23.11,41.91 21.59,43.43 21.59,45.59 20.32,46.86 HEADER1.8

### Text on the board
tNames: GND | B10 | B17 | B19 | B21 | B23 | RST | TMS | TDI | G | NRSTB | FWUP | A11 | A9 | A7 | A5 | A3 | A1 | GND | 5V | B9 | B14 | B18 | B20 | B22 | B24 | TCK | TDO | 3.3V | A12 | A10 | A8 | A6 | A4 | A2 | A0 | JTAGSEL | ERASE | Nov 2012 | SAM3U Breakout | 3.3V | A28 | A31 | B1 | B11 | B13 | B5 | B7 | GND | A22 | B3 | A13 | A15 | A17 | B15 | A19 | A21 | A24 | A26 | GND | A29 | B0 | B2 | B12 | A27 | B6 | B8 | REF | A30 | B4 | A14 | A16 | B16 | A18 | A20 | A23 | A25 | GND